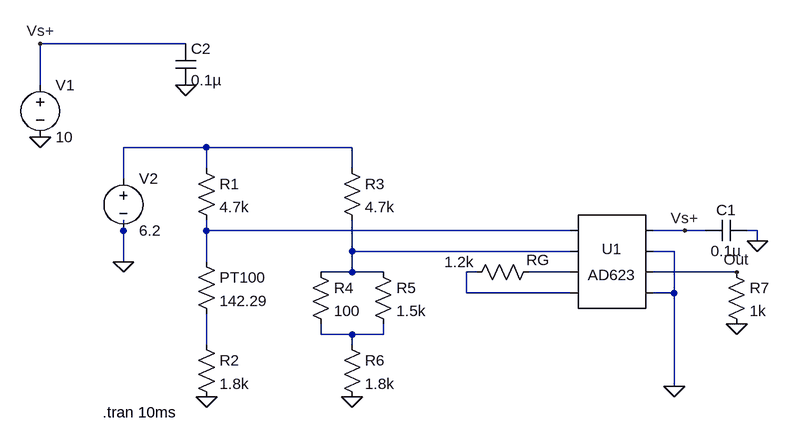
[diagram p0: schematic maritime_lab.asc]
maritime_lab.asc, the LTspice schematic file:
Version 4
SHEET 1 964 680
WIRE 48 -208 -176 -208
WIRE -176 -144 -176 -208
WIRE 80 -48 -48 -48
WIRE 304 -48 80 -48
WIRE 80 -16 80 -48
WIRE 304 -16 304 -48
WIRE -48 0 -48 -48
WIRE -48 80 -48 64
WIRE 80 80 80 64
WIRE 640 80 80 80
WIRE 816 80 768 80
WIRE 848 80 816 80
WIRE 928 80 912 80
WIRE 928 96 928 80
WIRE 304 112 304 64
WIRE 640 112 304 112
WIRE 800 112 768 112
WIRE -48 128 -48 80
WIRE 80 128 80 80
WIRE 304 144 304 112
WIRE 304 144 256 144
WIRE 352 144 304 144
WIRE 496 144 480 144
WIRE 640 144 576 144
WIRE 896 144 768 144
WIRE 480 176 480 144
WIRE 640 176 480 176
WIRE 800 176 800 112
WIRE 800 176 768 176
WIRE 256 240 256 224
WIRE 304 240 256 240
WIRE 352 240 352 224
WIRE 352 240 304 240
WIRE 80 256 80 208
WIRE 304 256 304 240
WIRE 800 320 800 176
FLAG 80 336 0
FLAG 304 336 0
FLAG -176 -64 0
FLAG -48 128 0
FLAG 800 320 0
FLAG 928 96 0
FLAG 48 -144 0
FLAG -176 -208 Vs+
FLAG 816 80 Vs+
FLAG 896 144 Out
FLAG 896 224 0
SYMBOL res 64 -32 R0
SYMATTR InstName R1
SYMATTR Value 4.7k
SYMBOL res 64 112 R0
SYMATTR InstName PT100
SYMATTR Value 142.29
SYMBOL res 64 240 R0
SYMATTR InstName R2
SYMATTR Value 1.8k
SYMBOL res 288 -32 R0
SYMATTR InstName R3
SYMATTR Value 4.7k
SYMBOL res 240 128 R0
SYMATTR InstName R4
SYMATTR Value 100
SYMBOL res 336 128 R0
SYMATTR InstName R5
SYMATTR Value 1.5k
SYMBOL res 288 240 R0
SYMATTR InstName R6
SYMATTR Value 1.8k
SYMBOL voltage -176 -160 R0
WINDOW 123 0 0 Left 0
WINDOW 39 0 0 Left 0
SYMATTR InstName V1
SYMATTR Value 10
SYMBOL AutoGenerated\\AD623 704 128 R0
SYMATTR InstName U1
SYMATTR SpiceModel ad623.cir
SYMBOL res 592 128 R90
WINDOW 0 13 2 VBottom 2
WINDOW 3 -15 123 VTop 2
SYMATTR InstName RG
SYMATTR Value 1.2k
SYMBOL cap 848 96 R270
WINDOW 0 32 32 VTop 2
WINDOW 3 0 32 VBottom 2
SYMATTR InstName C1
SYMATTR Value 0.1µ
SYMBOL cap 32 -208 R0
SYMATTR InstName C2
SYMATTR Value 0.1µ
SYMBOL voltage -48 -16 R0
WINDOW 123 0 0 Left 0
WINDOW 39 0 0 Left 0
SYMATTR InstName V2
SYMATTR Value 6.2
SYMBOL res 880 128 R0
SYMATTR InstName R7
SYMATTR Value 1k
TEXT -80 360 Left 2 !.tran 10ms

The netlist it stands for:
* maritime_lab.asc
R1 N001 N002 4.7k
R§PT100 N002 N007 142.29
R2 N007 0 1.8k
R3 N001 N003 4.7k
R4 N003 N006 100
R5 N003 N006 1.5k
R6 N006 0 1.8k
V1 Vs+ 0 10
* U1: AD623 (symbol AutoGenerated\AD623 not available, pins judged from their places): pin1=N002 pin2=N003 pin3=N005 pin4=N004 pin5=Vs+ pin6=0 pin7=Out pin8=0
RG N005 N004 1.2k
C1 Vs+ 0 0.1µ
C2 Vs+ 0 0.1µ
V2 N001 0 6.2
R7 Out 0 1k
.tran 10ms
.lib ad623.cir
.backanno
.end